# EAGLE design LED (EAGLE 6.5.0)
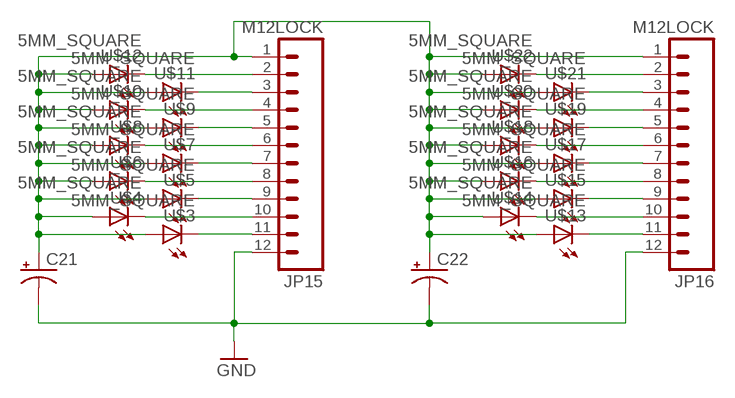
[diagram p0: schematic, sheet 1]

## Parts
C21  CPOL-USE2-5  [E2-5]
C22  CPOL-USE2-5  [E2-5]
JP15  M12LOCK  [1X12_LOCK]
JP16  M12LOCK  [1X12_LOCK]
U$3  5MM_SQUARE  [5MM_SQUARE]
U$4  5MM_SQUARE  [5MM_SQUARE]
U$5  5MM_SQUARE  [5MM_SQUARE]
U$6  5MM_SQUARE  [5MM_SQUARE]
U$7  5MM_SQUARE  [5MM_SQUARE]
U$8  5MM_SQUARE  [5MM_SQUARE]
U$9  5MM_SQUARE  [5MM_SQUARE]
U$10  5MM_SQUARE  [5MM_SQUARE]
U$11  5MM_SQUARE  [5MM_SQUARE]
U$12  5MM_SQUARE  [5MM_SQUARE]
U$13  5MM_SQUARE  [5MM_SQUARE]
U$14  5MM_SQUARE  [5MM_SQUARE]
U$15  5MM_SQUARE  [5MM_SQUARE]
U$16  5MM_SQUARE  [5MM_SQUARE]
U$17  5MM_SQUARE  [5MM_SQUARE]
U$18  5MM_SQUARE  [5MM_SQUARE]
U$19  5MM_SQUARE  [5MM_SQUARE]
U$20  5MM_SQUARE  [5MM_SQUARE]
U$21  5MM_SQUARE  [5MM_SQUARE]
U$22  5MM_SQUARE  [5MM_SQUARE]

## Nets
GND: C21.- C22.- JP15.12 JP16.12
N$36: JP16.2 U$22.N(C)
N$37: JP16.3 U$21.N(C)
N$38: JP16.4 U$20.N(C)
N$39: JP16.5 U$19.N(C)
N$40: JP16.6 U$18.N(C)
N$41: JP16.7 U$17.N(C)
N$42: JP16.8 U$16.N(C)
N$43: JP16.9 U$15.N(C)
N$44: C21.+ C22.+ JP15.1 JP16.1 U$3.P(A) U$4.P(A) U$5.P(A) U$6.P(A) U$7.P(A) U$8.P(A) U$9.P(A) U$10.P(A) U$11.P(A) U$12.P(A) U$13.P(A) U$14.P(A) U$15.P(A) U$16.P(A) U$17.P(A) U$18.P(A) U$19.P(A) U$20.P(A) U$21.P(A) U$22.P(A)
N$45: JP15.2 U$12.N(C)
N$46: JP15.3 U$11.N(C)
N$47: JP15.4 U$10.N(C)
N$48: JP15.5 U$9.N(C)
N$49: JP15.6 U$8.N(C)
N$50: JP15.7 U$7.N(C)
N$51: JP15.8 U$6.N(C)
N$52: JP15.9 U$5.N(C)
N$53: JP15.10 U$4.N(C)
N$54: JP15.11 U$3.N(C)
N$55: JP16.10 U$14.N(C)
N$56: JP16.11 U$13.N(C)

## Library data of the parts
C21 C22 = rcl:CPOL-US: POLARIZED CAPACITOR, American symbol
JP15 JP16 = SparkFun-Connectors:M12: Header 12 Standard 12-pin 0.1" header. Use with straight break away headers (SKU : PRT-00116), right angle break away headers (PRT-00553), swiss pins (PRT-00743), machine pins (PRT-00117), and female headers (PRT-00115).
U$3-U$22 = led:5MM_SQUARE

## Board
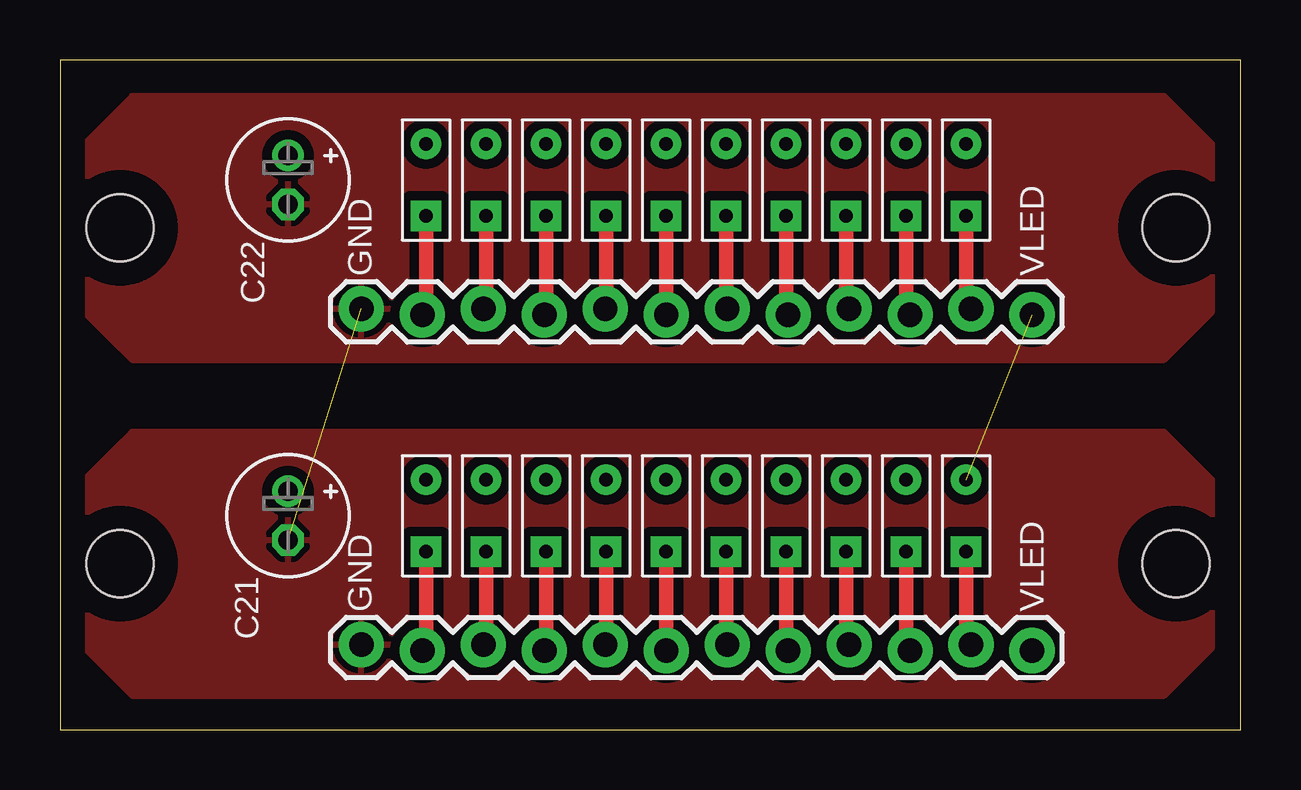
[diagram p1: board, top side]
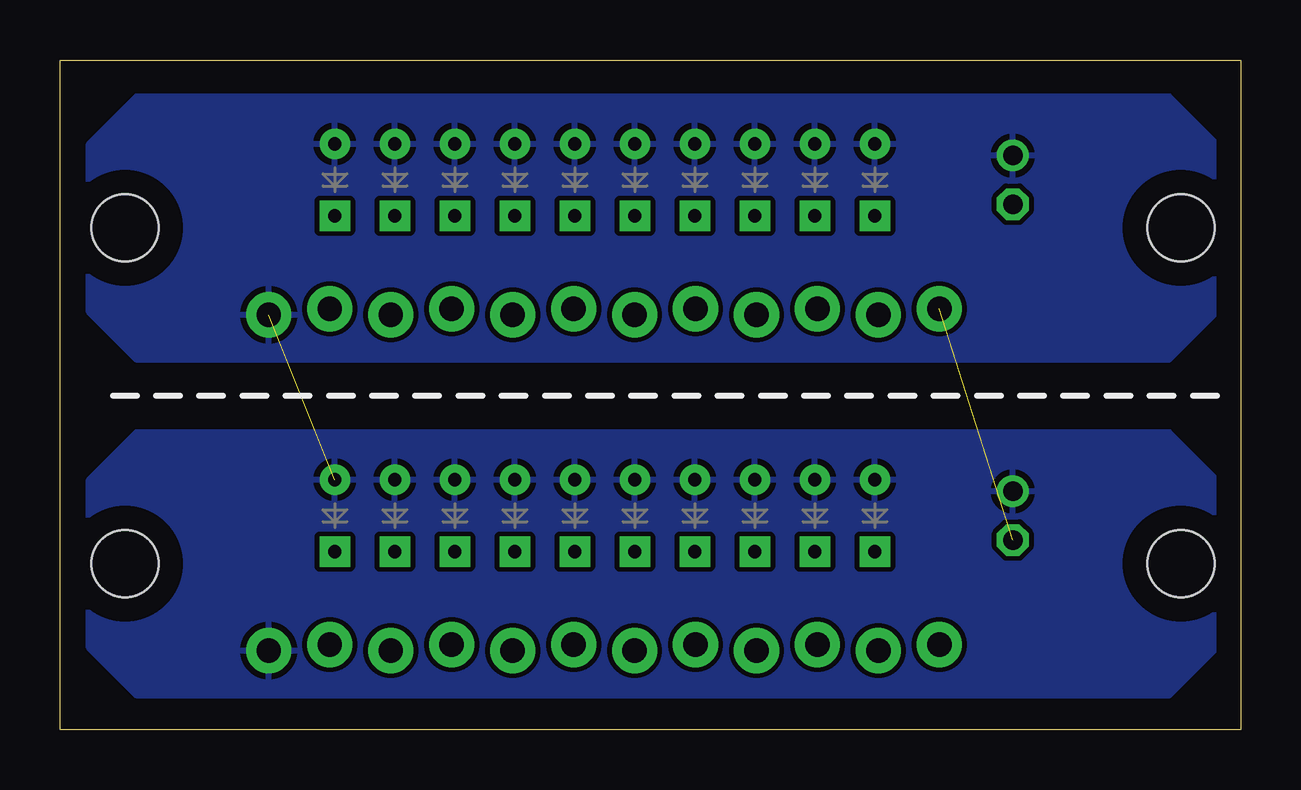
[diagram p2: board, bottom side, seen from below]

Size 49.2 x 27.92 mm. Coordinates in mm from the lower left corner, seen from the top.
Outline: 0,0 49.2,0 49.2,27.92 0,27.92 0,0
Copper layers (1*16): Top 0.035mm / dielectric 1.5mm / Bottom 0.035mm
Design rules "default": minimum track width 10mil, minimum drill 24mil, track to track 8mil, track to pad 8mil, pad to pad 8mil, via to via 8mil, smd to smd 8mil, copper to edge 40mil, drill to drill 8mil, minimum pad ring 10mil, minimum via ring 8mil, stop-mask expansion 4mil, vias tented up to drill 0mil, thermal gap 10mil
Holes 2.8 mm at 2.5,6.92 46.5,6.92 2.5,20.92 46.5,20.92

### Footprints (pad centres in the part's own frame; a part is rotated, then mirrored left to right if it is on the bottom)
E2-5 = drill 0.813 pad 1.27: + -1.016,0 | drill 0.813 pad 1.27 octagon: - 1.016,0
1X12_LOCK = drill 1.016 pad 1.88: 1 0,0.127; 2 2.54,-0.127; 3 5.08,0.127; 4 7.62,-0.127; 5 10.16,0.127; 6 12.7,-0.127; 7 15.24,0.127; 8 17.78,-0.127; 9 20.32,0.127; 10 22.86,-0.127; 11 25.4,0.127; 12 27.94,-0.127
5MM_SQUARE = drill 0.55 pad 1.27 square: N -1.5,0 | drill 0.55 pad 1.27: P 1.5,0

### Placement (x,y rotation side)
C21  9.5,8.92 270 top
C22  9.5,22.92 270 top
JP15  40.5,3.42 180 top
JP16  40.5,17.42 180 top
U$3  15.25,8.92 90 top
U$4  17.75,8.92 90 top
U$5  20.25,8.92 90 top
U$6  22.75,8.92 90 top
U$7  25.25,8.92 90 top
U$8  27.75,8.92 90 top
U$9  30.25,8.92 90 top
U$10  32.75,8.92 90 top
U$11  35.25,8.92 90 top
U$12  37.75,8.92 90 top
U$13  15.25,22.92 90 top
U$14  17.75,22.92 90 top
U$15  20.25,22.92 90 top
U$16  22.75,22.92 90 top
U$17  25.25,22.92 90 top
U$18  27.75,22.92 90 top
U$19  30.25,22.92 90 top
U$20  32.75,22.92 90 top
U$21  35.25,22.92 90 top
U$22  37.75,22.92 90 top

### Tracks (layer width: path | path; a pad name or v marks a point on that pad's centre or on a via)
GND  (1 unrouted)
  pour Top (isolate 0.406): 46,12.42 3,12.42 1,10.42 1,3.42 3,1.42 46,1.42 48,3.42 48,10.42
  pour Top (isolate 0.406): 46,26.42 3,26.42 1,24.42 1,17.42 3,15.42 46,15.42 48,17.42 48,24.42
N$36
  Top 0.61: U$22.N 37.75,17.26 JP16.2
N$37
  Top 0.61: U$21.N 35.25,16.96 JP16.3
N$38
  Top 0.61: U$20.N 32.75,17.18 JP16.4
N$39
  Top 0.61: U$19.N 30.25,16.88 JP16.5
N$40
  Top 0.61: U$18.N 27.75,17.1 JP16.6
N$41
  Top 0.61: U$17.N 25.25,16.8 JP16.7
N$42
  Top 0.61: U$16.N 22.75,17.08 JP16.8
N$43
  Top 0.61: U$15.N 20.25,16.86 JP16.9
N$44  (1 unrouted)
  pour Bottom: 46,12.42 3,12.42 1,10.42 1,3.42 3,1.42 46,1.42 48,3.42 48,10.42
  pour Bottom: 46,26.42 3,26.42 1,24.42 1,17.42 3,15.42 46,15.42 48,17.42 48,24.42
N$45
  Top 0.61: U$12.N 37.75,3.26 JP15.2
N$46
  Top 0.61: U$11.N 35.25,2.96 JP15.3
N$47
  Top 0.61: U$10.N 32.75,3.18 JP15.4
N$48
  Top 0.61: U$9.N 30.25,2.88 JP15.5
N$49
  Top 0.61: U$8.N 27.75,3.1 JP15.6
N$50
  Top 0.61: U$7.N 25.25,2.8 JP15.7
N$51
  Top 0.61: U$6.N 22.75,3.08 JP15.8
N$52
  Top 0.61: U$5.N 20.25,2.86 JP15.9
N$53
  Top 0.61: U$4.N 17.75,3.16 JP15.10
N$54
  Top 0.61: U$3.N 15.25,2.94 JP15.11
N$55
  Top 0.61: U$14.N 17.75,17.16 JP16.10
N$56
  Top 0.61: U$13.N 15.25,16.94 JP16.11

### Text on the board
tPlace: GND | VLED | GND | VLED